# Altium project DS134-1.1色度传感器.PrjPCB
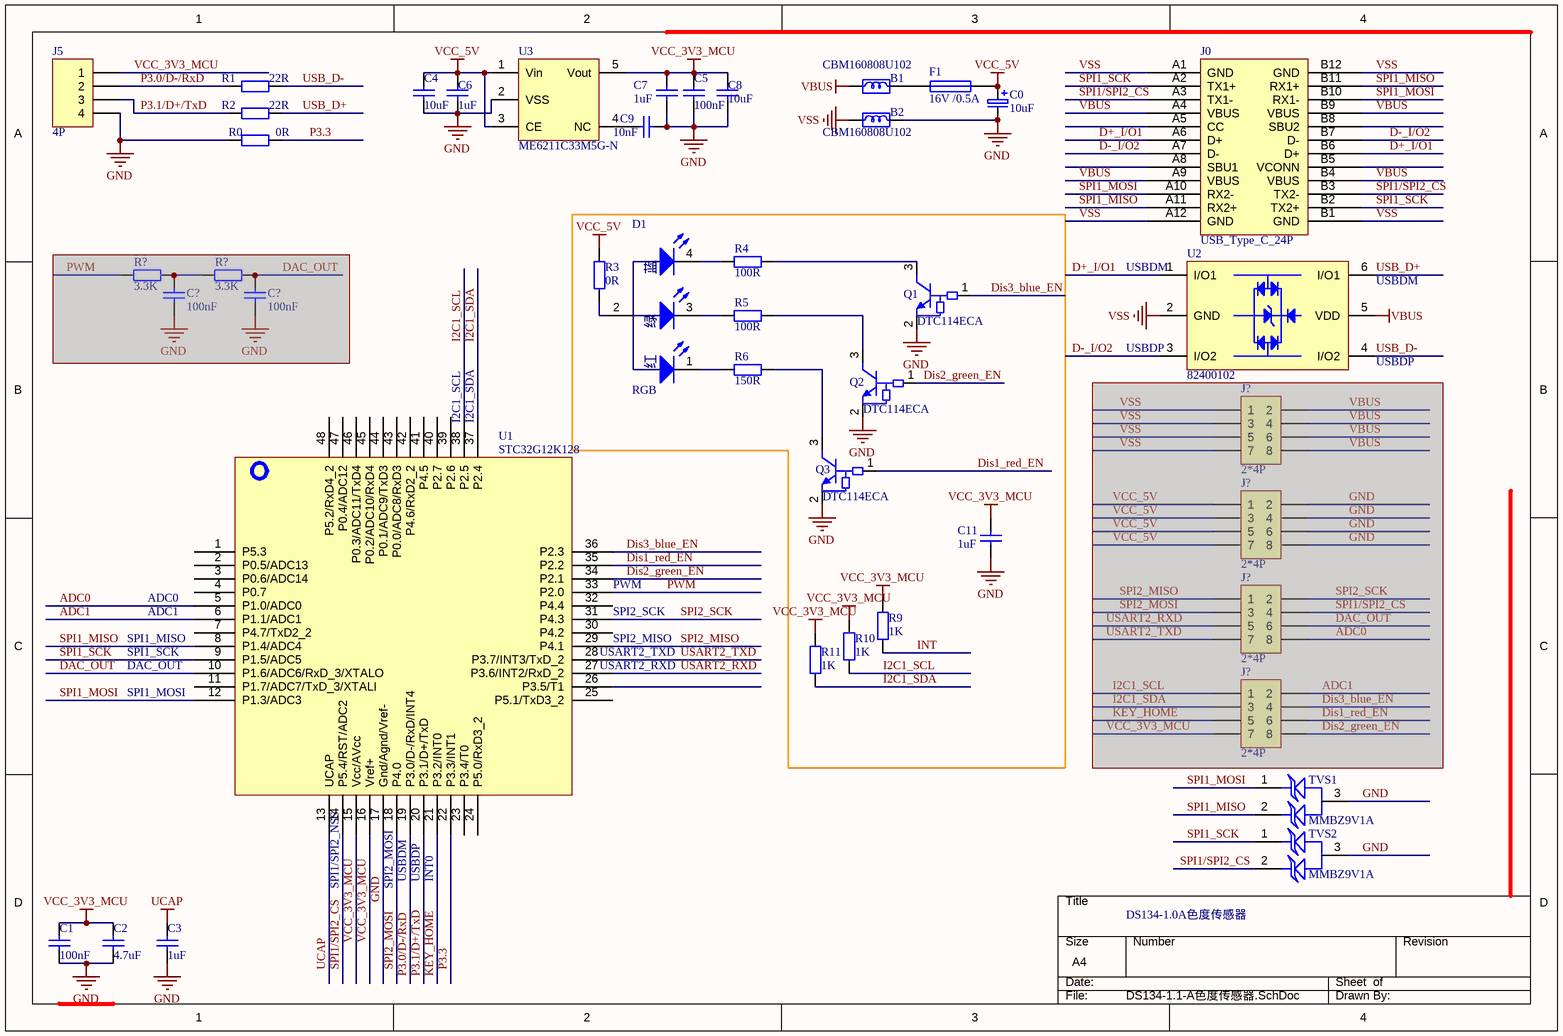
[diagram p0: DS134-1.1-A色度传感器.SchDoc]
2 sheets, 44 parts. Net scope: global (net labels, ports and power ports of the same name join across sheets).
Board files: DS134-1.1-A色度传感器.PcbDoc, DS134-1.1-B色度传感器.PcbDoc
Sheets:
  DS134-1.1-A色度传感器.SchDoc
  DS134-1.1-B色度传感器.SchDoc

## Sheet DS134-1.1-A色度传感器.SchDoc
size A4

### Parts
(Parts that share a designator on the sheet are numbered #1, #2 ... from top to bottom, then left to right.)
B1  CBM160808U102  [0603Bead]
B2  CBM160808U102  [0603Bead]
C0  value 10uF  [AVX_3216-18(1206)_SMD]  (hidden comment: AVX_10uF/16V ±10％(C106))
C1  value 100nF  [0603CAP]  (hidden comment: SMDCAP00013)
C2  value 4.7uF  [0603CAP]  (hidden comment: SMDCAP00012)
C3  value 1uF  [0603CAP]  (hidden comment: SMDCAP00015)
C4  value 10uF  [1206CAP]  (hidden comment: MLCC 10uF 50V ±20％ 1206)
C5  value 100nF  [0603CAP]  (hidden comment: SMDCAP00013)
C6  value 1uF  [0603CAP]  (hidden comment: SMDCAP00015)
C7  value 1uF  [0603CAP]  (hidden comment: SMDCAP00015)
C8  value 10uF  [1206CAP]  (hidden comment: MLCC 10uF 50V ±20％ 1206)
C9  value 10nF  [0603CAP]  (hidden comment: SMDCAP00010)
C11  value 1uF  [0603CAP]  (hidden comment: SMDCAP00015)
C?#1  value 100nF  [0603CAP]  (hidden comment: SMDCAP00013)  (masked out: inside a compile mask, not in the netlist)
C?#2  value 100nF  [0603CAP]  (hidden comment: SMDCAP00013)  (masked out: inside a compile mask, not in the netlist)
D1  value RGB  [LED_RGB_YANG5]  (hidden comment: DIPRGB00001)
F1  value 16V /0.5A  [1206FUSE]  (hidden comment: SMD1206-050C-16V)
J0  USB_Type_C_24P  [USB_TYPE_C_24P_Receptacle]
J5  value 4P  [H4]  (hidden comment: DIP4单排直针  间距2mm 针长11mm 铜)
J?#1  value 2*4P  [X1321FVS-2x04-C43D48]  (hidden comment: X1321FVS-2x04-C43D48)  (masked out: inside a compile mask, not in the netlist)
J?#2  value 2*4P  [X1321FVS-2x04-C43D48]  (hidden comment: X1321FVS-2x04-C43D48)  (masked out: inside a compile mask, not in the netlist)
J?#3  value 2*4P  [X1321FVS-2x04-C43D48]  (hidden comment: X1321FVS-2x04-C43D48)  (masked out: inside a compile mask, not in the netlist)
J?#4  value 2*4P  [X1321FVS-2x04-C43D48]  (hidden comment: X1321FVS-2x04-C43D48)  (masked out: inside a compile mask, not in the netlist)
Q1  value DTC114ECA  [SOT23]  (hidden comment: SMDIC000037)
Q2  value DTC114ECA  [SOT23]  (hidden comment: SMDIC000037)
Q3  value DTC114ECA  [SOT23]  (hidden comment: SMDIC000037)
R0  value 0R  [0603RES]  (hidden comment: Chip 0R 1/16W ±1％ 0603)
R1  value 22R  [0603RES]  (hidden comment: Chip 22R 1/16W ±1％ 0603)
R2  value 22R  [0603RES]  (hidden comment: Chip 22R 1/16W ±1％ 0603)
R3  value 0R  [0603RES]  (hidden comment: SMDRES00015)
R4  value 100R  [0603RES]
R5  value 100R  [0603RES]
R6  value 150R  [0603RES]
R9  value 1K  [0603RES]  (hidden comment: SMDRES00034)
R10  value 1K  [0603RES]  (hidden comment: SMDRES00034)
R11  value 1K  [0603RES]  (hidden comment: SMDRES00034)
R?#1  value 3.3K  [0603RES]  (hidden comment: SMDRES00090)  (masked out: inside a compile mask, not in the netlist)
R?#2  value 3.3K  [0603RES]  (hidden comment: SMDRES00090)  (masked out: inside a compile mask, not in the netlist)
TVS1  MMBZ9V1A  [SOT23]
TVS2  MMBZ9V1A  [SOT23]
U1  value STC32G12K128  [LQFP-48]  (hidden comment: STC32G12K128_35I LQFP48)
U2  82400102  [SOT23-6]
U3  ME6211C33M5G-N  [SOT23-5]

### Nets
GND: B2.2 C0.2 C1.1 C2.1 C3.1 C4.1 C5.1 C6.1 C7.1 C8.1 C9.2 C11.1 J5.4 Q1.2(GND) Q2.2(GND) Q3.2(GND) R0.1 TVS1.3 TVS2.3 U1.17(Gnd/Agnd/Vref-) U3.2(VSS)
UCAP: C3.2 U1.13(UCAP)
VBUS: B1.1 J0.A4(VBUS) J0.A9(VBUS) J0.B4(VBUS) J0.B9(VBUS) U2.5(VDD)
VCC_3V3_MCU: C1.2 C2.2 C5.2 C7.2 C8.2 C11.2 J5.1 R9.1 R10.1 R11.1 U1.15(Vcc/AVcc) U1.16(Vref+) U3.5(Vout)
VCC_5V: C0.1 C4.2 C6.2 F1.2 R3.1 U3.1(Vin) U3.3(CE)
VSS: B2.1 J0.A1(GND) J0.A12(GND) J0.B1(GND) J0.B12(GND) U2.2(GND)
ADC0: U1.5(P1.0/ADC0)
ADC1: U1.6(P1.1/ADC1)
D+_I/O1: J0.A6(D+) J0.B6(D+) U2.1(I/O1)
D-_I/O2: J0.A7(D-) J0.B7(D-) U2.3(I/O2)
DAC_OUT: U1.10(P1.6/ADC6/RxD_3/XTALO)
Dis1_red_EN: Q3.1(IN) U1.35(P2.2)
Dis2_green_EN: Q2.1(IN) U1.34(P2.1)
Dis3_blue_EN: Q1.1(IN) U1.36(P2.3)
I2C1_SCL: R10.2 U1.38(P2.5)
I2C1_SDA: R11.2 U1.37(P2.4)
INT: R9.2
KEY_HOME: U1.21(P3.2/INT0)
P3.0/D-/RxD: J5.2 R1.1 U1.19(P3.0/D-/RxD/INT4)
P3.1/D+/TxD: J5.3 R2.1 U1.20(P3.1/D+/TxD)
P3.3: R0.2 U1.22(P3.3/INT1)
PWM: U1.33(P2.0)
SPI1/SPI2_CS: J0.A3(TX1-) J0.B3(TX2-) TVS2.2 U1.14(P5.4/RST/ADC2)
SPI1_MISO: J0.A11(RX2+) J0.B11(RX1+) TVS1.2 U1.8(P1.4/ADC4)
SPI1_MOSI: J0.A10(RX2-) J0.B10(RX1-) TVS1.1 U1.12(P1.3/ADC3)
SPI1_SCK: J0.A2(TX1+) J0.B2(TX2+) TVS2.1 U1.9(P1.5/ADC5)
SPI2_MISO: U1.29(P4.1)
SPI2_MOSI: U1.18(P4.0)
SPI2_SCK: U1.31(P4.3)
USART2_RXD: U1.27(P3.6/INT2/RxD_2)
USART2_TXD: U1.28(P3.7/INT3/TxD_2)
USB_D+: R2.2 U2.6(I/O1)
USB_D-: R1.2 U2.4(I/O2)
NetB1_2: B1.2 F1.1
NetC9_1: C9.1 U3.4(NC)
NetD1_1: D1.1 R6.1
NetD1_2: D1.2 R3.2
NetD1_3: D1.3 R5.1
NetD1_4: D1.4 R4.1
NetQ1_3: Q1.3(OUT) R4.2
NetQ2_3: Q2.3(OUT) R5.2
NetQ3_3: Q3.3(OUT) R6.2

Not connected (* = marked no-connect by the designer): J0 A5(CC) A8(SBU1) B5(VCONN) B8(SBU2); U1 1(P5.3) 2(P0.5/ADC13) 3(P0.6/ADC14) 4(P0.7) 7(P4.7/TxD2_2) 11(P1.7/ADC7/TxD_3/XTALI) 23(P3.4/T0) 24(P5.0/RxD3_2) 25(P5.1/TxD3_2) 26(P3.5/T1) 30(P4.2) 32(P4.4) 39(P2.6) 40(P2.7) 41(P4.5) 42(P4.6/RxD2_2) 43(P0.0/ADC8/RxD3) 44(P0.1/ADC9/TxD3) 45(P0.2/ADC10/RxD4) 46(P0.3/ADC11/TxD4) 47(P0.4/ADC12) 48(P5.2/RxD4_2)

### Notes on the sheet
- (near U2) USBDM
- (near U2) USBDP
- (near U1) I2C1_SCL
- (near U1) I2C1_SDA
- (near U1) SPI1_MISO
- SPI1_SCK
- ADC0
- ADC1
- (near U1) USART2_TXD
- (near U1) PWM
- (near U1) SPI2_SCK
- (near U1) SPI2_MISO
- DAC_OUT
- (near U1) SPI1_MOSI
- (near U1) USART2_RXD
- (near U1) SPI1/SPI2_NSS
- (near U1) SPI2_MOSI
- USBDM
- USBDP
- INT0
- DS134-1.0A色度传感器
- DWG. NO.
- REV.
- SHT.
- THIS DOCUMENT AND THE DATA DISCLOSED HEREIN OR HEREWITH IS THE PROPERTY OF ALTIUM LIMITED AND MAY BE FREELY DISTRIBUTED IN WHOLE. NO RIGHTS ARE RESERVED OR EXPRESS OR IMPLIED WARANTEE GIVEN.
- REVISION
- DESCRIPTION
- DATE
- APPROVED
- ENG:
- APPROVALS
- PROJECT
- DSN:
- CHK:
- REFERENCE DOCUMENTS
- PROJECT REVISION:
- TITLE
- DOCUMENT REVISION:
- DESIGN ITEM:
- BOM:
- FAB DWG:
- PCB DWG:
- ASSY DWG:
- SCALE:
- SIZE
- B
- CAGE CODE
- FILE NAME
- DWG NO.
- SHEET
- OF
- REV
- (in symbol Φ5 RGB 透明 共阳 DIP4) 蓝; 绿; 红

### Library data of the parts
B1 B2 = Chip Ferrite Bead 0606: 贴片磁珠
C0 = AVX_10uF/16V ±10％(C106): 钽电容
C1 C5 C?#1 C?#2 = MLCC 100nF 50V ±10％ 0603: 贴片电容
C2 = MLCC 4.7uF 50V ±10％ 0603: 贴片电容
C3 C6 C7 C11 = MLCC 1uF 50V ±10％ 0603: 贴片电容
C4 C8 = MLCC 10uF 50V ±20％ 1206: 贴片电容
C9 = MLCC 10nF 50V ±10％ 0603: 贴片电容
D1 = Φ5 RGB 透明 共阳 DIP4: RGB插件LED
F1 = SMD1206-050C-16V: 贴片自恢复保险丝 16V /0.5A
J5 = DIP4单排直针  间距2mm 针长11mm 铜: 单排直针
J?#1-J?#4 = X1321FVS-2x04-C43D48: 双排母2x4P 立贴 1.27mm
Q1-Q3 = DTC114ECA SOT-23 长电: 数字晶体管
R0 = Chip 0R 1/16W ±1％ 0603: 贴片电阻
R1 R2 = Chip 22R 1/16W ±1％ 0603: 贴片电阻
R3-R6 = Chip 100R 1/16W ±1％ 0603: 贴片电阻
R9-R11 = Chip 1K 1/16W ±1％ 0603: 贴片电阻
R?#1 R?#2 = Chip 3.3K 1/16W ±1％ 0603: 贴片电阻
TVS1 TVS2 = TVS: 瞬态抑制二极管
U1 = STC32G12K128_35I LQFP48: 单片机芯片
U2 = 82400102: 瞬态抑制二极管(TVS)
U3 = ME6211C33M5G-N: 稳压芯片

## Sheet DS134-1.1-B色度传感器.SchDoc
size A4
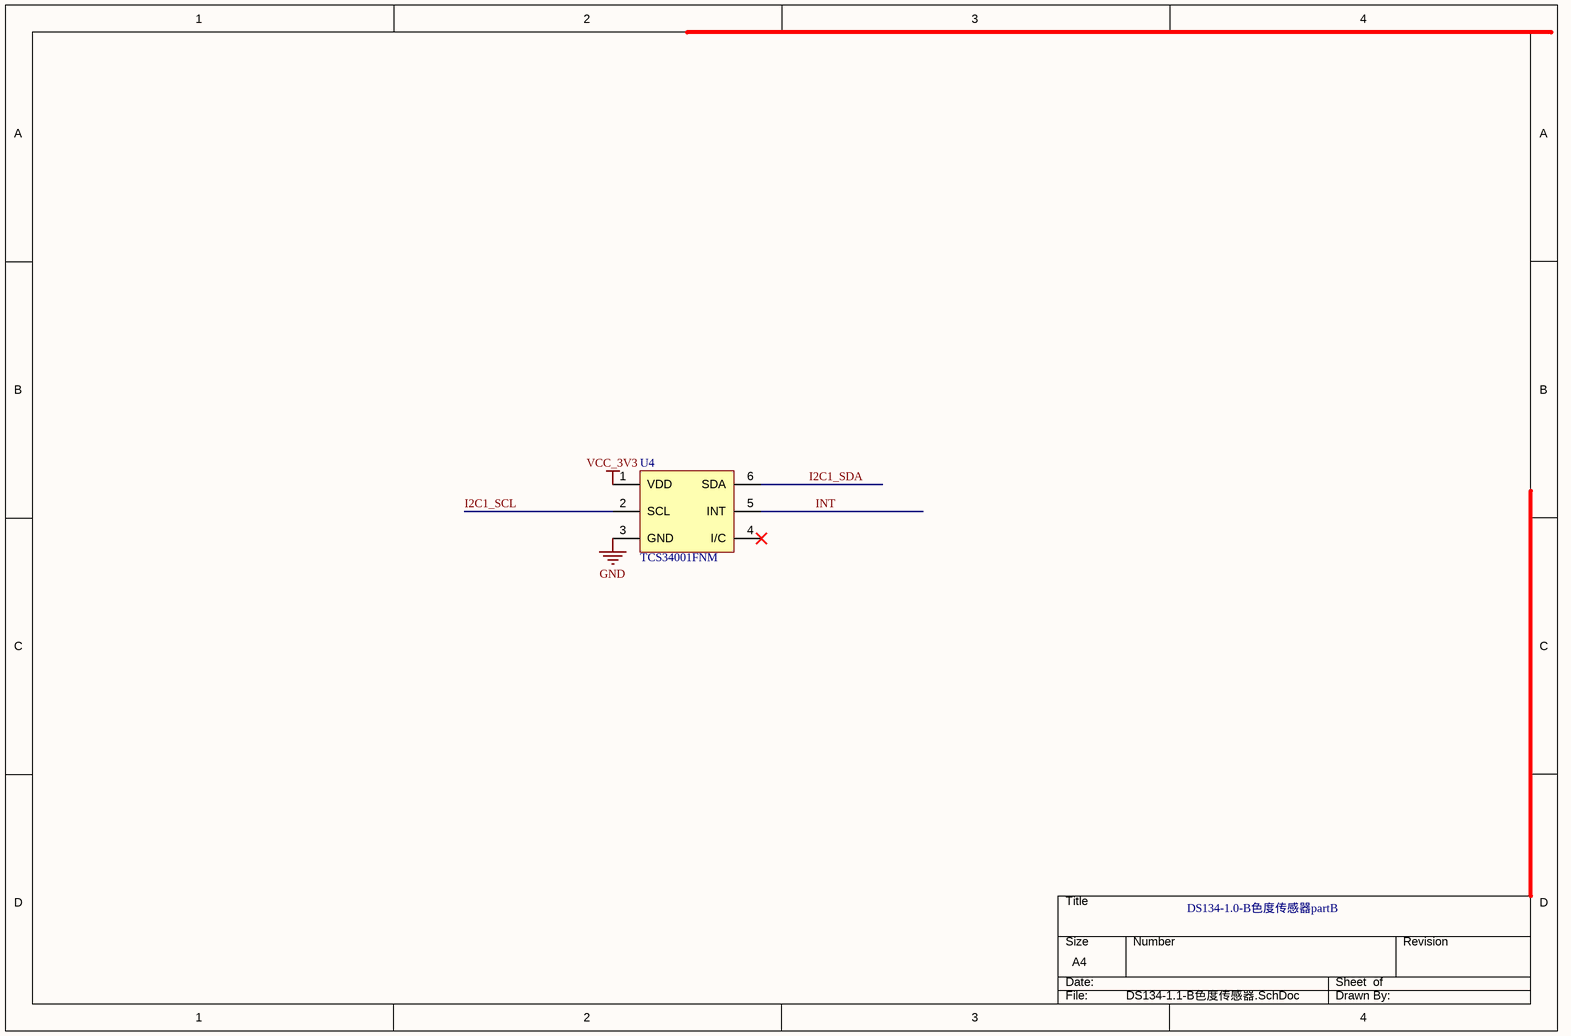
[diagram p1: DS134-1.1-B色度传感器.SchDoc]

### Parts
U4  TCS34001FNM  [DFN-6(2x2.4)]

### Nets
GND: U4.3(GND)
VCC_3V3: U4.1(VDD)
I2C1_SCL: U4.2(SCL)
I2C1_SDA: U4.6(SDA)
INT: U4.5(INT)

Not connected (* = marked no-connect by the designer): U4 4(I/C)*

### Notes on the sheet
- DS134-1.0-B色度传感器partB
- DWG. NO.
- REV.
- SHT.
- THIS DOCUMENT AND THE DATA DISCLOSED HEREIN OR HEREWITH IS THE PROPERTY OF ALTIUM LIMITED AND MAY BE FREELY DISTRIBUTED IN WHOLE. NO RIGHTS ARE RESERVED OR EXPRESS OR IMPLIED WARANTEE GIVEN.
- REVISION
- DESCRIPTION
- DATE
- APPROVED
- ENG:
- APPROVALS
- PROJECT
- DSN:
- CHK:
- REFERENCE DOCUMENTS
- PROJECT REVISION:
- TITLE
- DOCUMENT REVISION:
- DESIGN ITEM:
- BOM:
- FAB DWG:
- PCB DWG:
- ASSY DWG:
- SCALE:
- SIZE
- B
- CAGE CODE
- FILE NAME
- DWG NO.
- SHEET
- OF
- REV

### Library data of the parts
U4 = TCS34001FNM: 环境光传感器

## Nets that join several sheets
GND: DS134-1.1-A色度传感器 (21 pins), DS134-1.1-B色度传感器 (U4.3)
I2C1_SCL: DS134-1.1-A色度传感器 (R10.2 U1.38), DS134-1.1-B色度传感器 (U4.2)
I2C1_SDA: DS134-1.1-A色度传感器 (R11.2 U1.37), DS134-1.1-B色度传感器 (U4.6)
INT: DS134-1.1-A色度传感器 (R9.2), DS134-1.1-B色度传感器 (U4.5)